# EAGLE schematic v2 (EAGLE 9.6.2)
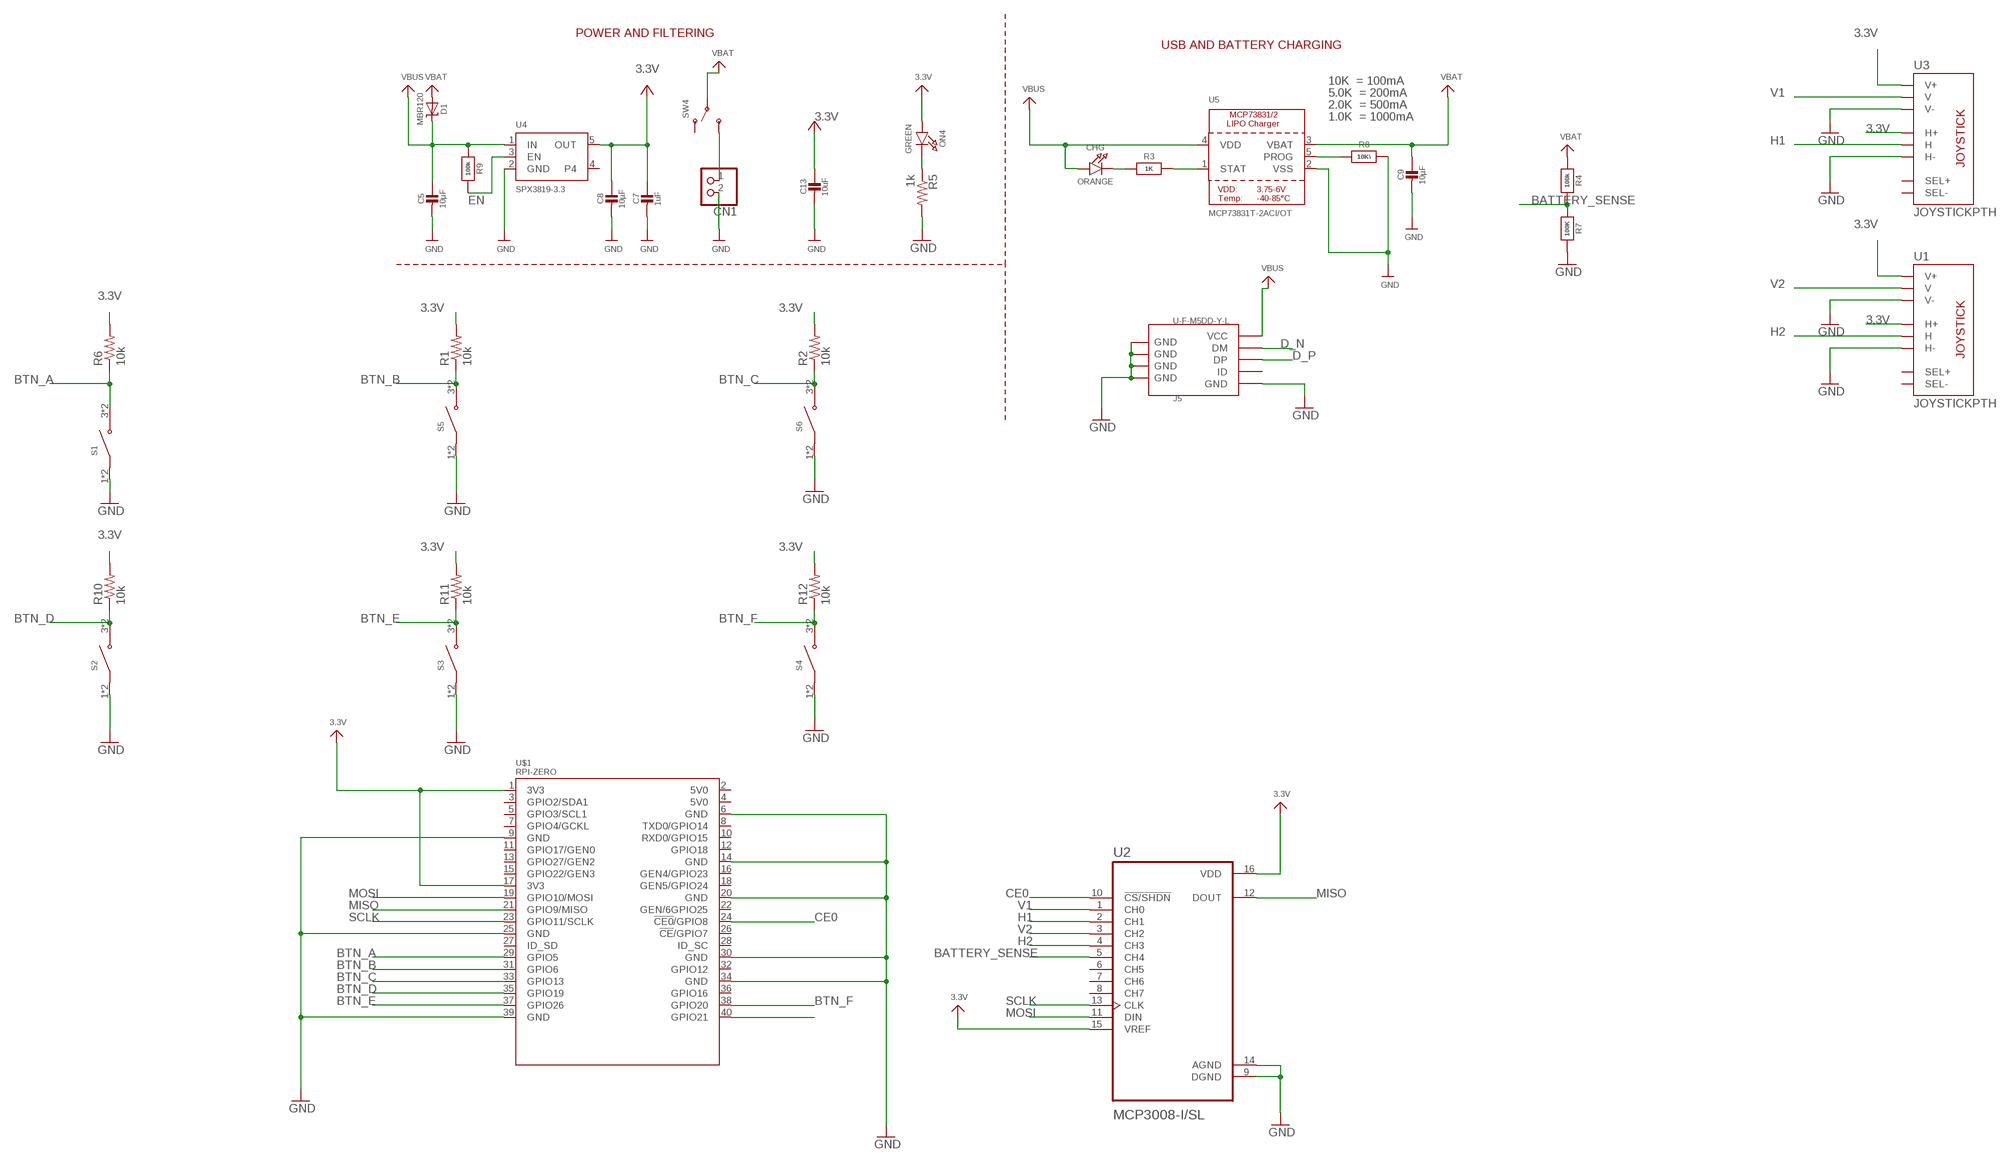
[diagram p0: schematic, sheet 1]

## Parts
C5  10µF  CAP_CERAMIC0805-NOOUTLINE  [0805-NO]
C7  1uF  CAP_CERAMIC0603_NO  [0603-NO]
C8  10µF  CAP_CERAMIC0805-NOOUTLINE  [0805-NO]
C9  10µF  CAP_CERAMIC0805-NOOUTLINE  [0805-NO]
C13  10uF  CAP_CERAMIC0805-NOOUTLINE  [0805-NO]
CHG  ORANGE  LED0805_NOOUTLINE  [CHIPLED_0805_NOOUTLINE]
CN1  JST_2PIN-THM-RA  [JST-PH-2-THM-RA]
D1  MBR120  DIODE-SCHOTTKYSOD-123  [SOD-123]
J5  U-F-M5DD-Y-L  USB-MICROE  [MICRO-SMD]
ON4  GREEN  LED0805_NOOUTLINE  [CHIPLED_0805_NOOUTLINE]
R1  10k  R-US_R0603  [R0603]
R2  10k  R-US_R0603  [R0603]
R3  1K  RESISTOR_0603_NOOUT  [0603-NO]
R4  100k  RESISTOR_0603_NOOUT  [0603-NO]
R5  1k  R-US_R0603  [R0603]
R6  10k  R-US_R0603  [R0603]
R7  100K  RESISTOR_0603_NOOUT  [0603-NO]
R8  10K\  RESISTOR_0603_NOOUT  [0603-NO]
R9  100k  RESISTOR_0603_NOOUT  [0603-NO]
R10  10k  R-US_R0603  [R0603]
R11  10k  R-US_R0603  [R0603]
R12  10k  R-US_R0603  [R0603]
S1  B3F-4050  [SW_B3F-4050]
S2  B3F-4050  [SW_B3F-4050]
S3  B3F-4050  [SW_B3F-4050]
S4  B3F-4050  [SW_B3F-4050]
S5  B3F-4050  [SW_B3F-4050]
S6  B3F-4050  [SW_B3F-4050]
SW4  SWITCH_SPDT  [SPDT_SMT_SSSS811101]
U1  JOYSTICKPTH  [JOYSTICK]
U2  MCP3008-I/SL  [SOIC127P600X175-16N]
U3  JOYSTICKPTH  [JOYSTICK]
U4  SPX3819-3.3  VREG_SOT23-5  [SOT23-5]
U5  MCP73831T-2ACI/OT  MCP73831/2  [SOT23-5]
U$1  RPI-ZERO  [RASPBERRYPI_BASTELSTUBE_V13_RASPI_BOARD_B+_FULL]

## Nets
3.3V [5V]: C7.1 C8.1 C13.1 ON4.A R1.2 R2.2 R6.2 R10.2 R11.2 R12.2 U1.H1(H+) U1.V1(V+) U2.15(VREF) U2.16(VDD) U3.H1(H+) U3.V1(V+) U4.5(OUT) U$1.1(3V3) U$1.17(3V3) ; supply symbol labelled +3V3
BATTERY_SENSE: R4.2 R7.1 U2.5(CH4)
BTN_A: R6.1 S1.3(NO) S1.4(NO) U$1.29(GPIO5)
BTN_B: R1.1 S5.3(NO) S5.4(NO) U$1.31(GPIO6)
BTN_C: R2.1 S6.3(NO) S6.4(NO) U$1.33(GPIO13)
BTN_D: R10.1 S2.3(NO) S2.4(NO) U$1.35(GPIO19)
BTN_E: R11.1 S3.3(NO) S3.4(NO) U$1.37(GPIO26)
BTN_F: R12.1 S4.3(NO) S4.4(NO) U$1.38(GPIO20)
CE0: U2.10(!CS/SHDN) U$1.24(!CE0!/GPIO8)
D_N [USB]: J5.D-(DM)
D_P [USB]: J5.D+(DP)
EN: R9.2 U4.3(EN)
GND: C5.2 C7.2 C8.2 C9.2 C13.2 CN1.2 J5.GND J5.S1(GND) J5.S1@1(GND) J5.S1@2(GND) J5.S2(GND) J5.S2@1(GND) J5.S2@2(GND) J5.S3(GND) J5.S3@1(GND) J5.S3@2(GND) J5.S4(GND) J5.S4@1(GND) J5.S4@2(GND) J5.S5(GND) J5.S6(GND) R5.2 R7.2 R8.2 S1.1(COM) S1.2(COM) S2.1(COM) S2.2(COM) S3.1(COM) S3.2(COM) S4.1(COM) S4.2(COM) S5.1(COM) S5.2(COM) S6.1(COM) S6.2(COM) U1.H3(H-) U1.V3(V-) U2.9(DGND) U2.14(AGND) U3.H3(H-) U3.V3(V-) U4.2(GND) U5.2(VSS) U$1.6(GND) U$1.9(GND) U$1.14(GND) U$1.20(GND) U$1.25(GND) U$1.30(GND) U$1.34(GND) U$1.39(GND)
H1: U2.2(CH1) U3.H2(H)
H2: U1.H2(H) U2.4(CH3)
MISO: U2.12(DOUT) U$1.21(GPIO9/MISO)
MOSI: U2.11(DIN) U$1.19(GPIO10/MOSI)
N$1: CHG.C R3.1
N$2: CN1.1 SW4.C(S)
N$3: R3.2 U5.1(STAT)
N$4: R8.1 U5.5(PROG)
N$7: U$1.40(GPIO21)
N$9: ON4.C R5.1
SCLK: U2.13(CLK) U$1.23(GPIO11/SCLK)
V1: U2.1(CH0) U3.V2(V)
V2: U1.V2(V) U2.3(CH2)
VBAT [5V]: C9.1 D1.A R4.1 SW4.B(P) U5.3(VBAT)
VBUS [5V]: C5.1 CHG.A D1.C J5.VBUS(VCC) R9.1 U4.1(IN) U5.4(VDD)
Unconnected: J5.ID SW4.A(O) U1.B1A(SEL+) U1.B2A(SEL-) U2.6(CH5) U2.7(CH6) U2.8(CH7) U3.B1A(SEL+) U3.B2A(SEL-) U4.4 U$1.2(5V0) U$1.3(GPIO2/SDA1) U$1.4(5V0) U$1.5(GPIO3/SCL1) U$1.7(GPIO4/GCKL) U$1.8(TXD0/GPIO14) U$1.10(RXD0/GPIO15) U$1.11(GPIO17/GEN0) U$1.12(GPIO18) U$1.13(GPIO27/GEN2) U$1.15(GPIO22/GEN3) U$1.16(GEN4/GPIO23) U$1.18(GEN5/GPIO24) U$1.22(GEN/6GPIO25) U$1.26(!CE!/GPIO7) U$1.27(ID_SD) U$1.28(ID_SC) U$1.32(GPIO12) U$1.36(GPIO16)

## Notes on the sheet
- POWER AND FILTERING
- USB AND BATTERY CHARGING
- 10K  = 100mA
- 5.0K  = 200mA
- 2.0K  = 500mA
- 1.0K  = 1000mA

## Library data of the parts
C5 C7-C9 C13 = microbuilder:CAP_CERAMIC: Ceramic Capacitors For new designs, use the packages preceded by an '_' character since they are more reliable: The following footprints should be used on most boards: _0402 - Standard footprint for regular board layouts _0603 - Standard footprint for regular board layouts _0805 - Standard footprint for regular board layouts _1206 - Standard footprint for regular board layouts For extremely tight-pitch boards where space is at a premium, the following 'micro-pitch' footprints can be used (smaller pads, no silkscreen outline, etc.): _0402MP - Micro-pitch footprint for very dense/compact boards _0603MP - Micro-pitch footprint for very dense/compact boards _0805MP - Micro-pitch footprint for very dense/compact boards _1206MP - Micro-pitch footprint for very dense/compact boards
CHG ON4 = microbuilder:LED: LED 0603 - 0603 Surface Mount Package 2mA: Green LED - Low Power (3.9mcd, 2ma, 1.7Vf) - Digikey: 475-2709-2-ND Orange LED - Low Power (9.8mcd, 2ma, 1.8Vf) - Digikey: 475-1194-2-ND Red LED - Low Power (5mcd, 2ma, 1.8Vf) - Digikey: 475-1195-2-ND Yellow LED - Low Power (7mcd, 2ma, 1.8Vf) - Digikey: 475-1196-2-ND 5mA: Blue LED - Low Power (17mcd, 5ma, 2.9Vf) - Digikey: LNJ937W8CRACT-ND 0805 - 0805 Surface Mount Package 2mA: Red LED (8.8mcd, 2mA, 1.8Vf, Clear) - Low Power [Digikey: 475-2510-1-ND] Green LED (5mcd, 2mA, 1.8Vf, Clear) - Low Power [Digikey: 475-2730-1-ND] Yellow LED (11.3mcd, 2mA, 1.8Vf, Clear) - Low Power [Digikey: 475-2555-1-ND] 20mA: Red LED (104mcd, 20mA, Diffused) - LS R976 [Digikey: 475-1278-6-ND] Red LED (12mcd, 20mA, 2.0Vf, Clear) - APT2012EC [Digikey: 754-1128-1-ND] Green LED (15mcd, 20mA, 2.2Vf, Clear) - APT2012GC [Digikey: 754-1131-1-ND] Orange LED (160mcd, 20mA, 2.1Vf, Clear) - APT2012SECK [Digikey: 754-1130-1-ND] 1206 - 1206 Surface Mount Package Green LED (26mcd, 20mA, Diffused) - LG N971 [Digikey: 475-1407-6-ND] Red LED (15mcd, 20mA, Diffused) - LH N974 [Digikey: 475-1416-6-ND] Cree - Cree High-Power Surface Mount LEDs XPEBWT-L1-0000-00D50 - White 111lm 350mA 2.9Vf 6200K 110° XTEAWT-00-0000-00000LEE3 - White 114lm 350mA 2.85Vf 5000K 115° Everlight - Everlight 45-21 Series Surface Mount LEDs 45-21/QK2C-B2832AC2CB2/2T - Warm White 2000mcd 20mA 3.25Vf 3050K 120° 45-21/LK2C-B38452C4CB2/2T - Nuetral White 2000mcd 20mA 3.25Vf 4150K 120° 45-21/LK2C-B50634C6CB2/2T - Cold White 2200mcd 20mA 3.25Vf 5650K 120° PLCC2 Reverse Mount LS T77K-J1L2-1-0-2-R18-Z - Red 11.25mcd 2mA 1.8Vf 630nm 120° LO T77K-L1M2-24-Z - Orange 19.6mcd 2mA 1.8Vf 606nm 120° LY T77K-K2M1-26-Z - Yellow 15.7mcd 2mA 1.8Vf 587nm 120°
CN1 = adafruit:JST_2PIN: JST 2-Pin Connectors of various flavors SMT-RA (S2B-PH-SM4) 4UConnector #17311 SMT (B2B-PH-SM4) THM-RA (S2B-PH) THM (B2B-PH)
D1 = microbuilder:DIODE-SCHOTTKY
J5 = Connector_NOA:USB-MICROE
R1 R2 R5 R6 R10-R12 = adafruit:R-US_: RESISTOR, American symbol
R3 R4 R7-R9 = microbuilder:RESISTOR: Resistors For new designs, use the packages preceded by an '_' character since they are more reliable: The following footprints should be used on most boards: _0402 - Standard footprint for regular board layouts _0603 - Standard footprint for regular board layouts _0805 - Standard footprint for regular board layouts _1206 - Standard footprint for regular board layouts For extremely tight-pitch boards where space is at a premium, the following 'micro-pitch' footprints can be used (smaller pads, no silkscreen outline, etc.): _0402MP - Micro-pitch footprint for very dense/compact boards _0603MP - Micro-pitch footprint for very dense/compact boards _0805MP - Micro-pitch footprint for very dense/compact boards _1206MP - Micro-pitch footprint for very dense/compact boards
S1-S6 = B3F-4050:B3F-4050; DESCRIPTION: Tactile Switch SPST-NO Top Actuated Through Hole; DIGI-KEY_PART_NUMBER: SW413-ND; MF: Omron Electronics; MP: B3F-4050; PACKAGE: None; PURCHASE-URL: https://pricing.snapeda.com/search/part/B3F-4050/?ref=eda
SW4 = microbuilder:SWITCH_SPDT: Switch - SPDT SSSS811101 - Horizontal Two Position SMT, 0.3A 4V [Mouser: 688-SSSS811101]
U1 U3 = adafruit:JOYSTICK: Thumb Joystick Joystick commonly found in PS2 controllers. Two pots and a select switch. Adapted from Sparkfun Library (but for more common 6mm switch sticks)
U2 = MCP3008-I_SL:MCP3008-I/SL: Check prices <https://pricing.snapeda.com/parts/MCP3008-I/SL/Microchip/view-part?ref=eda>; AVAILABILITY: Good; DESCRIPTION: 10 Bit Analog to Digital Converter 4, 8 Input 1 SAR 16-SOIC; MF: Microchip; MP: MCP3008-I/SL; PACKAGE: SOIC-16 Microchip; PRICE: None; PURCHASE-URL: https://pricing.snapeda.com/search/part/MCP3008-I/SL/?ref=eda
U4 = microbuilder:VREG_SOT23-5: SOT23-5 Fixed Voltage Regulators Part Current Out V Out V In V Dropout θJA (°C/W) TJ (°C) Digikey Part No. ADP121 150mA 3.3V 3.4-5.5V 0.09V @ 150mA -- -- ADP121-AUJZ33R7CT-ND ADP121 150mA 3.0V 3.1-5.5V 0.09V @ 150mA -- -- ADP121-AUJZ30R7CT-ND ADP122 300mA 3.3V 3.4-5.5V 0.085V @ 300mA -- -- ADP122AUJZ-3.3-R7CT-ND ADP1712 300mA 3.3V 3.5-5.5V 0.17V @ 300mA -- -- ADP1712AUJZ-3.3-R7TR-ND AP7311 (Low Cost) 150mA 3.3V 3.5-6V 0.15V @ 150mA -- -- AP7311-33WG-7DICT-ND LD39015M18R 150mA 1.8V 1.9V-5.5V 0.08V @ 100mA -- -- 497-6977-1-ND LP2985A-33DBVR 150mA 3.3V 3.3-16V 0.28V @ 150mA 206 150 296-18479-1-ND MCP1824T-3302E/OT 300mA 3.3V 3.5V-6V 0.2V @ 300mA -- -- MCP1824T-3302E/OTCT-ND MIC5205-2.5YM5 TR 150mA 2.5V 2.7-16V 0.165V @ 150mA -- -- 576-1257-2-ND MIC5205-3.0YM5 TR 150mA 3.0V 3.2V-16V 0.165V @ 150mA -- -- 576-1258-2-ND MIC5205-3.3YM5 TR 150mA 3.3V 3.5V-16V 0.165V @ 150mA -- -- 576-1259-2-ND TPS780330220 150mA 3.3V+2.2V 3.6-5.5V 250mV Max -- -- 296-23332-1-ND TDA3663/N1,135 100mA 3.3V 3.5-45V 0.18V @ 50mA -- -- 568-5343-1-ND Max operating temp can be calculated using θJA, TJ (max junction temperature), and power in watts. Set the "Maximum Ambient Temperature" until it reaches TJ ("Max Junction Temperature"), which is the absolute limit for safe use of the regulator: Heat Sink Temperature Calculator <http://www.daycounter.com/Calculators/Heat-Sink-Temperature-Calculator.phtml> For example, With 12V source into a 3.3V LP2985 and a 30mA load, we are dissipating (12V-3.3V) * 0.03A = 0.261W. With a θJA of 206 °C/W, a TJ of 150°C, and 261mW we can safely use the chip without a heat sink up to 75°C (=147.1°C Junction Temperature).
U5 = microbuilder:MCP73831/2: MCP73831/2 LIPO Charger VDD: 3.75 - 6V Temp -40 - 85°C Programmable Charge Rate: 15-500mA NOTE: STAT is a tri-state logic output on the MCP73831 and an open-drain output on the MCP73832. SOT23-5 with 4.2V output and tri-state logic on STAT = MCP73831T-2ACI/OT
U$1 = RPI-Zero:RPI-ZERO

## Net classes
0 default: width 0.15 mm, drill 0.3 mm, clearance 0.2 mm
1 USB: drill 0.3 mm, clearance 0.2 mm
3 usbvcc: drill 0.3 mm, clearance 0.2 mm
4 5V: width 0.4 mm, drill 0.3 mm, clearance 0.4 mm